# Altium schematic sheet simplefoc-stepmini_2024-05-25.schdoc
size 221 x 128 mm
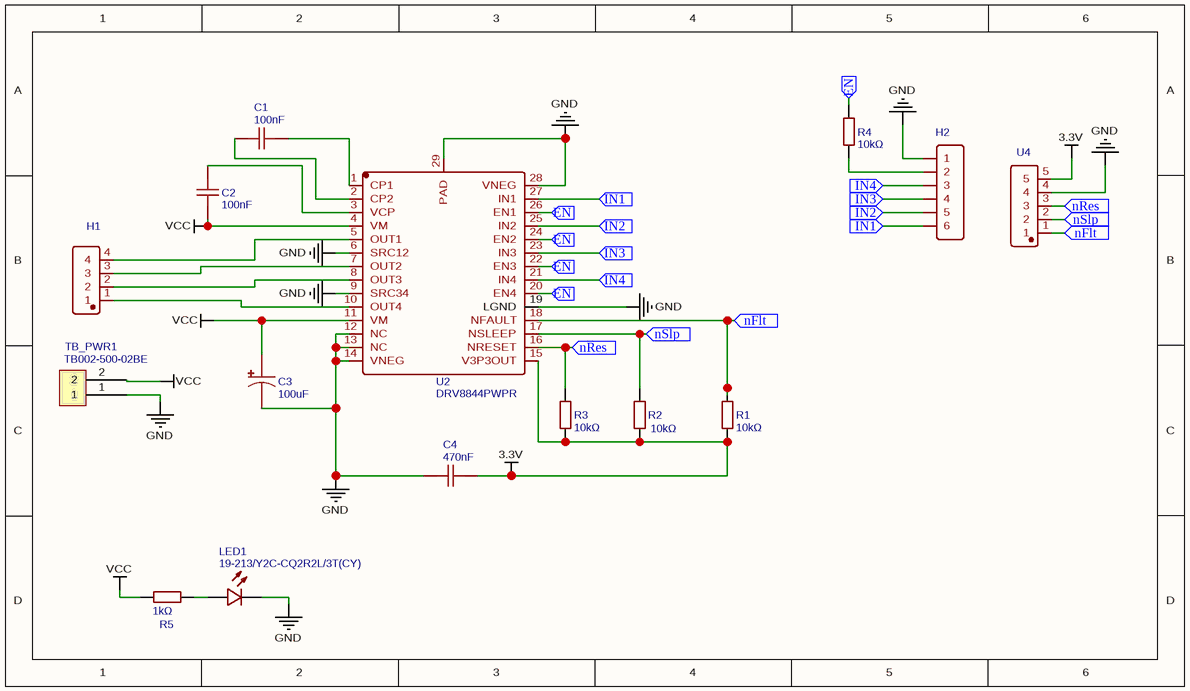
[diagram p0: simplefoc-stepmini_2024-05-25.schdoc]

## Parts
C1  100nF  [C0603]
C2  100nF  [C0603]
C3  100uF  [CAP-SMD_BD6.3-L6.6-W6.6-FD]
C4  470nF  [C0603]
H1  KH-2.54PH180-1X4P-L11.5  [HDR-TH_4P-P2.54-V-M]  (value not drawn)
H2  Header-Male-2.54_1x6  [HDR-TH_6P-P2.54-V-M-1]  (value not drawn)
LED1  19-213/Y2C-CQ2R2L/3T(CY)  [LED0603-R-RD]
R1  10kΩ  [R0603]
R2  10kΩ  [R0603]
R3  10kΩ  [R0603]
R4  10kΩ  [R0603]
R5  1kΩ  [R0603]
TB_PWR1  TB002-500-02BE  [TB002-500-02BE]
U2  DRV8844PWPR  [HTSSOP-28_L9.8-W4.5-P0.65-LS6.6-BL-EP]
U4  KH-2.54FH-1X5P-H8.5  [HDR-TH_5P-P2.54-V-F]  (value not drawn)

## Ports
EN (in), IN1 (in), IN2 (in), IN3 (in), IN4 (in), nFlt (in), nRes (in), nSlp (in)

## Nets
3.3V: C4.2 R1.1 R2.1 R3.1 U2.15(V3P3OUT) U4.5
GND: C3.2 C4.1 H2.1 LED1.2(C) TB_PWR1.1 U2.6(SRC12) U2.9(SRC34) U2.12(NC) U2.13(NC) U2.14(VNEG) U2.19(LGND) U2.28(VNEG) U2.29(PAD) U4.4
VCC: C2.1 C3.1 R5.1 TB_PWR1.2 U2.4(VM) U2.11(VM)
EN: R4.2 U2.20(EN4) U2.22(EN3) U2.24(EN2) U2.26(EN1) ; port EN
IN1: H2.6 U2.27(IN1) ; port IN1
IN2: H2.5 U2.25(IN2) ; port IN2
IN3: H2.4 U2.23(IN3) ; port IN3
IN4: H2.3 U2.21(IN4) ; port IN4
nFlt: R1.2 U2.18(NFAULT) U4.1 ; port nFlt
nRes: R3.2 U2.16(NRESET) U4.3 ; port nRes
nSlp: R2.2 U2.17(NSLEEP) U4.2 ; port nSlp
NetC1_1: C1.1 U2.2(CP2)
NetC1_2: C1.2 U2.1(CP1)
NetC2_2: C2.2 U2.3(VCP)
NetH1_1: H1.1 U2.10(OUT4)
NetH1_2: H1.2 U2.8(OUT3)
NetH1_3: H1.3 U2.7(OUT2)
NetH1_4: H1.4 U2.5(OUT1)
NetH2_2: H2.2 R4.1
NetLED1_1: LED1.1(A) R5.2

## Library data of the parts
C1 C2 = 100nF: Manufacturer: SAMSUNG; Manufacturer Part: CL10B104KB8NNNC; nameAlias: Capacitance; Supplier: LCSC; Supplier Part: C1591; spicePre: C; spiceSymbolName: CL10B104KB8NNNC
C3 = 100uF: Manufacturer: Vertical Technology; Manufacturer Part: VT1V101M-CRE77; nameAlias: Capacitance; Contributor: LCSC; Supplier: LCSC; Supplier Part: C294520; spicePre: C; spiceSymbolName: VT1V101M-CRE77
C4 = 470nF: Manufacturer: YAGEO; Manufacturer Part: CC0603ZRY5V6BB474; nameAlias: Capacitance; Contributor: LCSC; Supplier: LCSC; Supplier Part: C327269; spicePre: C; spiceSymbolName: CC0603ZRY5V6BB474
H1 = KH-2.54PH180-1X4P-L11.5: Manufacturer: kinghelm(金航标); Contributor: LCSC; Supplier: LCSC; Supplier Part: C2905435; Manufacturer Part: KH-2.54PH180-1X4P-L11.5; JLCPCB Part Class: Extended Part; spicePre: H; spiceSymbolName: KH-2.54PH180-1X4P-L11.5
H2 = Header-Male-2.54_1x6: Manufacturer: BOOMELE(博穆精密); Manufacturer Part: 2.54-1x6P直针; Supplier: LCSC; Supplier Part: C37208; JLCPCB Part Class: Extended Part; spicePre: H; spiceSymbolName: Header-Male-2.54_1x6
LED1 = 19-213/Y2C-CQ2R2L/3T(CY): Manufacturer: EVERLIGHT; Supplier: LCSC; Manufacturer Part: 19-213/Y2C-CQ2R2L/3T(CY); Supplier Part: C72038; JLCPCB Part Class: Basic Part; spicePre: L; spiceSymbolName: 19-213/Y2C-CQ2R2L/3T(CY)
R1-R4 = 10kΩ: Manufacturer: UniOhm; Manufacturer Part: 0603WAF4701T5E; nameAlias: Resistance; Resistance (Ohms): 4.7K; Supplier: LCSC; Supplier Part: C23162; JLCPCB Part Class: Basic Part; spicePre: R; spiceSymbolName: 0603WAF4701T5E
R5 = 1kΩ: Manufacturer: UniOhm; Manufacturer Part: 0603WAF4701T5E; nameAlias: Resistance; Resistance (Ohms): 4.7K; Supplier: LCSC; Supplier Part: C23162; JLCPCB Part Class: Basic Part; spicePre: R; spiceSymbolName: 0603WAF4701T5E
TB_PWR1 = TB002-500-02BE: Contributor: the.skuric; Supplier 1: Mouser; Supplier Part Number 1: 490-TB002-500-02BE; spicePre: T; spiceSymbolName: TB002-500-02BE
U2 = DRV8844PWPR: Manufacturer: TI(德州仪器); Contributor: LCSC; Supplier: LCSC; Supplier Part: C177807; Manufacturer Part: DRV8844PWPR; JLCPCB Part Class: Extended Part; spicePre: U; spiceSymbolName: DRV8844PWPR
U4 = KH-2.54FH-1X5P-H8.5: Manufacturer: kinghelm(金航标); Contributor: LCSC; Supplier: LCSC; Supplier Part: C2932671; Manufacturer Part: KH-2.54FH-1X5P-H8.5; spicePre: U; spiceSymbolName: KH-2.54FH-1X5P-H8.5